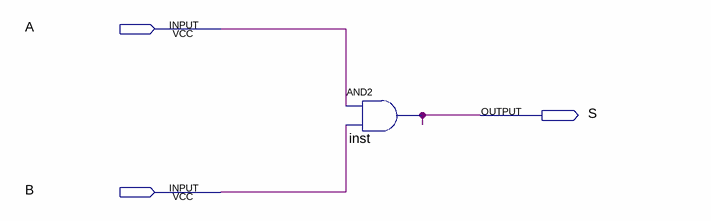
[diagram p0: schematic sheet]
// Quartus schematic Tutorial.bdf as structural Verilog: 1 symbols, 3 pins
module Tutorial (
  input  A,
  input  B,
  output S
);

  and inst (S, A, B);
endmodule
